# Altium schematic sheet CAN.SchDoc
size A4; Revision: C.2(PCB.SCH)
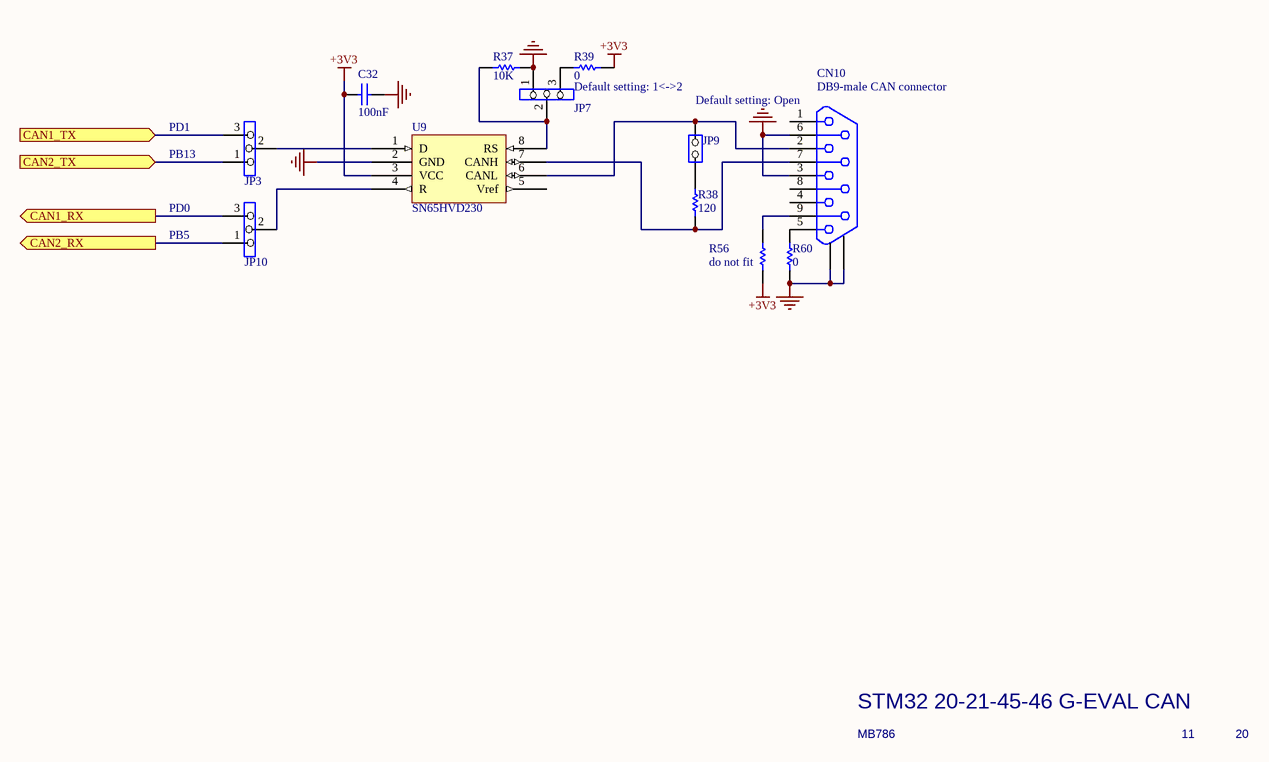
[diagram p0: CAN.SchDoc]

## Parts
C32  100nF  [0402C]
CN10  DB9-male CAN connector  [DB9/M]
JP3  (no value)  [SIP3]
JP7  (no value)  [SIP3]
JP9  (no value)  [SIP2]
JP10  (no value)  [SIP3]
R37  10K  [0402R]
R38  120  [0603R]
R39  0  [0603R]
R56  do not fit  [0603R]
R60  0  [0603R]
U9  SN65HVD230  [SO8]

## Ports
CAN1_RX (out), CAN1_TX (in), CAN2_RX (out), CAN2_TX (in)

## Nets
+3V3: C32.2 R39.2 R56.1 U9.3(VCC)
GND: C32.1 CN10.0 CN10.3 CN10.6 JP7.1 R37.2 R60.1 U9.2(GND)
CAN1_RX: JP10.3 ; port CAN1_RX
CAN1_TX: JP3.3 ; port CAN1_TX
CAN2_RX: JP10.1 ; port CAN2_RX
CAN2_TX: JP3.1 ; port CAN2_TX
NetCN10_2: CN10.2 JP9.2(NO) U9.6(CANL)
NetCN10_5: CN10.5 R60.2
NetCN10_7: CN10.7 R38.1 U9.7(CANH)
NetCN10_9: CN10.9 R56.2
NetJP3_2: JP3.2 U9.1(D)
NetJP7_2: JP7.2 R37.1 U9.8(RS)
NetJP7_3: JP7.3 R39.1
NetJP9_1: JP9.1(COMMON) R38.2
NetJP10_2: JP10.2 U9.4(R)

Not connected (* = marked no-connect by the designer): CN10 1 4 8; U9 5(Vref)

## Notes on the sheet
- Default setting: 1<->2
- (near CN10) Default setting: Open
- PD1
- PB13
- PD0
- PB5
- STM32 20-21-45-46 G-EVAL CAN
- MB786
- 11
- 20
- STMicroelectronics
- Title:
- Number:
- Rev:
- Date:
- Sheet       of

## Library data of the parts
C32 = CAP: Capacitor; Published: 8-Jun-2000; Revision: July-2002: Re-released for DXP Platform.; Publisher: Altium Limited; Value: 100nF
CN10 = DB9
JP3 JP7 JP10 = Jumper3
JP9 = JP2
R37-R39 R56 R60 = res1: Resistor; Value: 1K; Published: 8-Jun-2000; Revision: July-2002: Re-released for DXP Platform.; Publisher: Altium Limited
U9 = SN65HVD230D